# EAGLE design component-LMT70 (EAGLE 7.3.0)
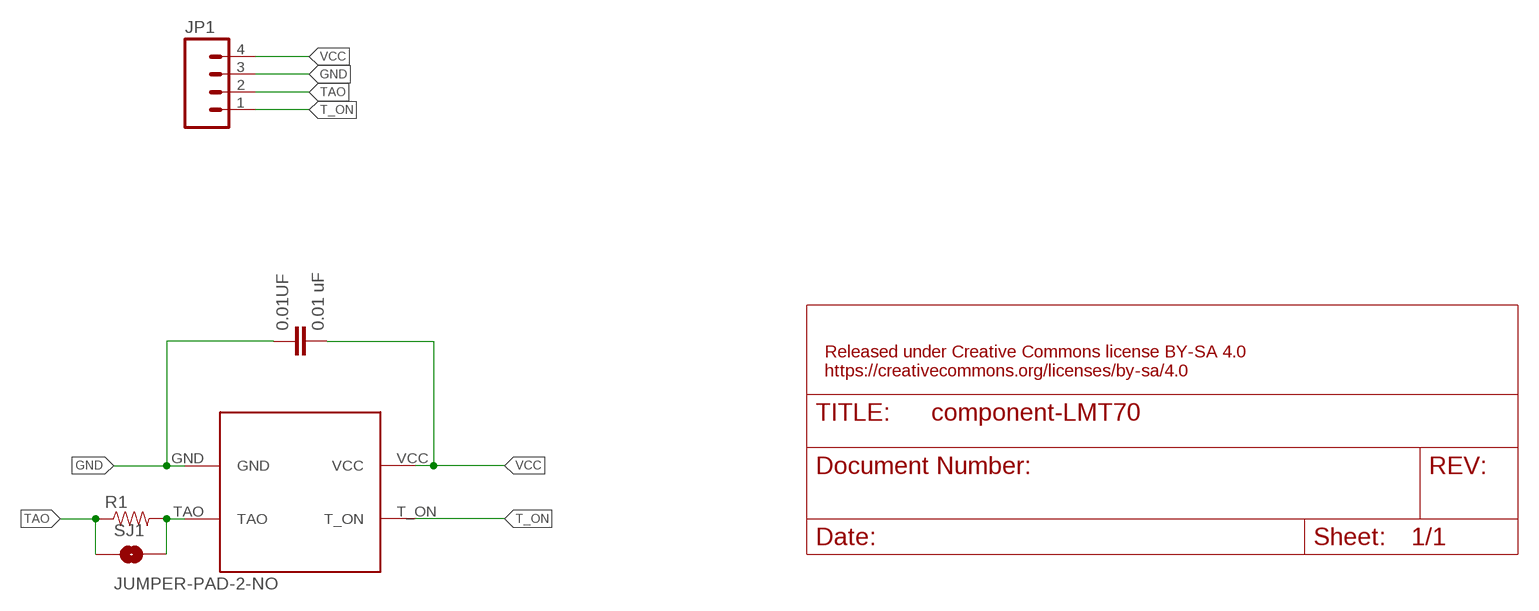
[diagram p0: schematic, sheet 1]

## Parts
0.01UF  0.01 uF  CAP0603-CAP  [0603-CAP]
JP1  M04NO_SILK_ALL_ROUND  [1X04_NO_SILK_ALL_ROUND]
R1  RESISTOR0603-RES  [0603-RES]
SJ1  JUMPER-PAD-2-NO  [PAD-JUMPER-2-NO_NO_SILK]
U$1  LMT70  [LMT-70]

## Nets
GND: 0.01UF.1 JP1.3 U$1.GND
N$3: R1.2 SJ1.2 U$1.TAO
T_ON: JP1.1 U$1.T_ON
TAO: JP1.2 R1.1 SJ1.1
VCC: 0.01UF.2 JP1.4 U$1.VCC

## Notes on the sheet
- Released under Creative Commons license BY-SA 4.0
  https://creativecommons.org/licenses/by-sa/4.0

## Library data of the parts
0.01UF = SparkFun-Passives:CAP: Capacitor Standard 0603 ceramic capacitor, and 0.1" leaded capacitor.
JP1 = SparkFun-Connectors:M04: Header 4 Standard 4-pin 0.1" header. Use with straight break away headers (SKU : PRT-00116), right angle break away headers (PRT-00553), swiss pins (PRT-00743), machine pins (PRT-00117), and female headers (PRT-00115). Molex polarized connector foot print use with SKU : PRT-08231 with associated crimp pins and housings. 1MM SMD Version SKU: PRT-10208
R1 = SparkFun-Passives:RESISTOR: Resistor Basic schematic elements and footprints for 0603, 1206, and PTH resistors.
SJ1 = SparkFun-Passives:JUMPER-PAD-2-NO
U$1 = awqua_eagle_library:LMT70

## Board
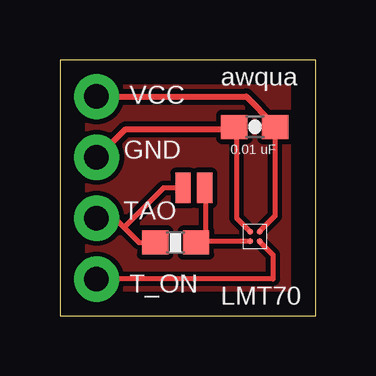
[diagram p1: board, top side]
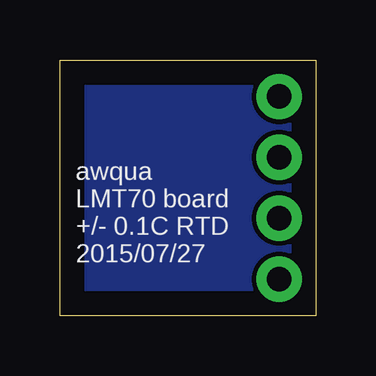
[diagram p2: board, bottom side, seen from below]

Size 10.67 x 10.67 mm. Coordinates in mm from the lower left corner, seen from the top.
Outline: 0,0 10.67,0 10.67,10.67 0,10.66 0,0
Copper layers (1*16): Top 0.035mm / dielectric 1.5mm / Bottom 0.035mm
Design rules "default *": minimum track width 10mil, minimum drill 12mil, track to track 8mil, track to pad 8mil, pad to pad 8mil, via to via 8mil, smd to smd 8mil, copper to edge 40mil, drill to drill 8mil, minimum pad ring 10mil, minimum via ring 8mil, stop-mask expansion 4mil, vias tented up to drill 13mil, thermal gap 10mil

### Footprints (pad centres in the part's own frame; a part is rotated, then mirrored left to right if it is on the bottom)
0603-CAP = smd 1.1 x 1: 1 -0.85,0; 2 0.85,0
1X04_NO_SILK_ALL_ROUND = drill 1.016 pad 1.88: 1 0,0; 2 2.54,0; 3 5.08,0; 4 7.62,0
0603-RES = smd 1.1 x 1: 1 -0.85,0; 2 0.85,0
PAD-JUMPER-2-NO_NO_SILK = smd 0.635 x 1.27: 1 -0.45,0; 2 0.45,0
LMT-70 = smd 0.24 x 0.24: GND -0.2,0.2; T_ON 0.2,-0.2; TAO -0.2,-0.2; VCC 0.2,0.2

### Placement (x,y rotation side)
0.01UF  8.13,7.87 0 top
JP1  1.52,1.52 90 top
R1  4.83,3.05 0 top
SJ1  5.59,5.33 0 top
U$1  8.13,3.3 0 top

### Tracks (layer width: path | path; a pad name or v marks a point on that pad's centre or on a via)
GND
  Top 0.152: 7.09,7.77 7.37,7.77 | 7.93,3.56 U$1.GND
  Top 0.203: 7.37,7.77 7.37,4.06 U$1.GND
  Top 0.254: 0.01UF.1 7.09,7.77 2.74,7.77 1.6,6.63 JP1.3
N$1
  pour Bottom: 0,10.67 10.67,10.67 10.67,0 0,0
N$2
  pour Top: 0,0 10.67,0 10.67,10.67 0,10.67
N$3
  Top 0.203: U$1.TAO 5.73,3.1 R1.2 5.84,3.05 6.1,3.3 6.1,5.28 SJ1.2
T_ON
  Top 0.203: U$1.T_ON 8.89,2.54 8.89,1.52 JP1.1
TAO
  Top 0.203: 2.67,3.68 3.3,3.05 R1.1 | 2.67,3.68 2.29,4.06 JP1.2 | SJ1.1 4.32,5.33 2.67,3.68
VCC
  Top 0.203: 0.01UF.2 8.98,4.15 U$1.VCC
  Top 0.254: JP1.4 7.77,9.14 8.91,8 0.01UF.2

### Text on the board
tPlace: awqua | VCC | GND | TAO | T_ON | LMT70
bPlace: awqua / LMT70 board / +/- 0.1C RTD / 2015/07/27
Document: Released under Creative Commons license BY-SA 4.0 / https://creativecommons.org/licenses/by-sa/4.0